# Altium schematic sheet 松菸_幻影光靈_屍禁_通靈板.SchDoc
size A4
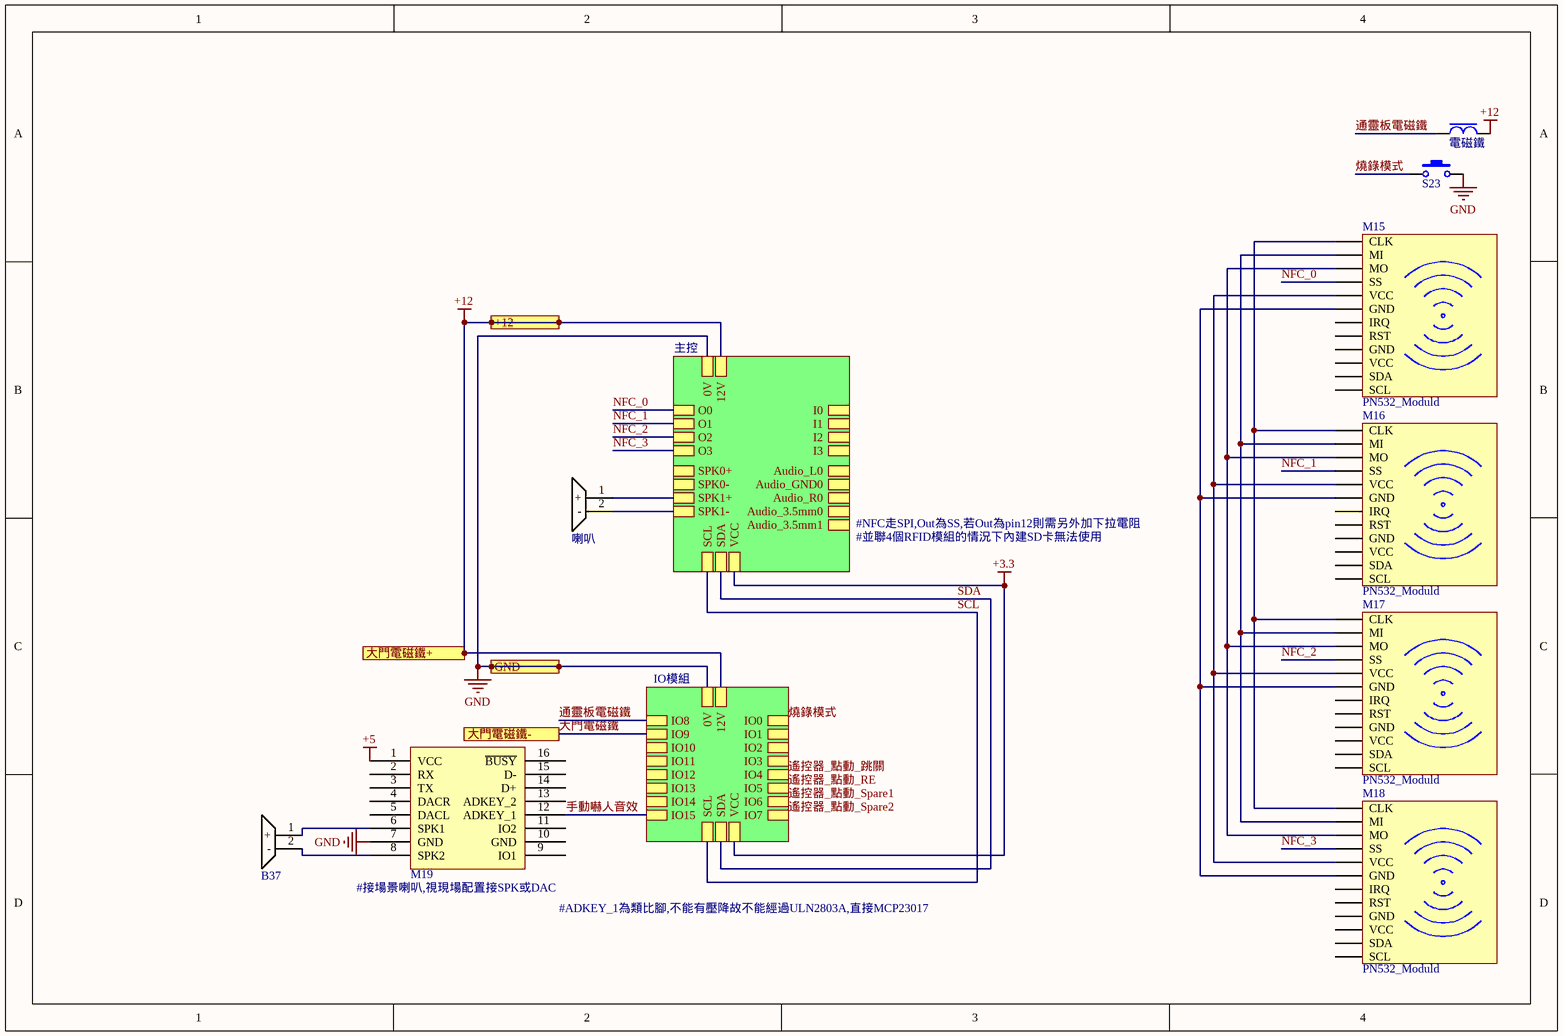
[diagram p0: 松菸_幻影光靈_屍禁_通靈板.SchDoc]

## Parts
B34  喇叭  [Buzzer_12085]
B37  FMB1275-05  [Buzzer_12085]  (value not drawn)
I8  電磁鐵  [Inductor-0420]
M15  PN532_Moduld  [PN532]
M16  PN532_Moduld  [PN532]
M17  PN532_Moduld  [PN532]
M18  PN532_Moduld  [PN532]
M19  BY8001-16P  [BY8001-16P]  (value not drawn)
S23  Switch  [Switch SMD-3.6*6*2.5]  (value not drawn)

## Sub-sheets
IO模組 = IO模組_MCP23017_20240819.SchDoc: VCC, 12V, 0V, SCL, SDA, IO15, IO14, IO10, IO0, IO3, IO4, IO5, IO8, IO11, IO6, IO7, IO12, IO13, IO2, IO1, IO9
主控 = ESP32主控_20240812.SchDoc: 12V, SDA, VCC, 0V, SCL, O3, O2, O1, O0, I3, I2, I1, I0, SPK0+, Audio_3.5mm1, Audio_L0, SPK0-, Audio_R0, SPK1+, SPK1-, Audio_3.5mm0, Audio_GND0

## Ports
+12, GND, 大門電磁鐵+, 大門電磁鐵-

## Nets
+3.3: sheet 主控/VCC, sheet IO模組/VCC
+5: M19.1(VCC)
+12: I8.2 ; port +12, port 大門電磁鐵+, sheet 主控/12V, sheet IO模組/12V
GND: M19.7(GND) S23.2 ; port GND, sheet 主控/0V, sheet IO模組/0V
NFC_0: M15.4(SS) ; sheet 主控/O0
NFC_1: M16.4(SS) ; sheet 主控/O1
NFC_2: M17.4(SS) ; sheet 主控/O2
NFC_3: M18.4(SS) ; sheet 主控/O3
SCL: sheet 主控/SCL, sheet IO模組/SCL
SDA: sheet 主控/SDA, sheet IO模組/SDA
大門電磁鐵: port 大門電磁鐵-, sheet IO模組/IO9
手動嚇人音效: M19.12(ADKEY_1) ; sheet IO模組/IO15
燒錄模式: S23.1 ; sheet IO模組/IO0
通靈板電磁鐵: I8.1 ; sheet IO模組/IO8
遙控器_點動_RE: sheet IO模組/IO5
遙控器_點動_Spare1: sheet IO模組/IO6
遙控器_點動_Spare2: sheet IO模組/IO7
遙控器_點動_跳關: sheet IO模組/IO4
NetB34_1: B34.1(+) ; sheet 主控/SPK1+
NetB34_2: B34.2(-) ; sheet 主控/SPK1-
NetB37_1: B37.1(+) M19.6(SPK1)
NetB37_2: B37.2(-) M19.8(SPK2)
NetM15_1: M15.1(CLK) M16.1(CLK) M17.1(CLK) M18.1(CLK)
NetM15_2: M15.2(MI) M16.2(MI) M17.2(MI) M18.2(MI)
NetM15_3: M15.3(MO) M16.3(MO) M17.3(MO) M18.3(MO)
NetM15_5: M15.5(VCC) M16.5(VCC) M17.5(VCC) M18.5(VCC)
NetM15_6: M15.6(GND) M16.6(GND) M17.6(GND) M18.6(GND)

Not connected (* = marked no-connect by the designer): M15 7(IRQ) 8(RST) 9(GND) 10(VCC) 11(SDA) 12(SCL); M16 7(IRQ) 8(RST) 9(GND) 10(VCC) 11(SDA) 12(SCL); M17 7(IRQ) 8(RST) 9(GND) 10(VCC) 11(SDA) 12(SCL); M18 7(IRQ) 8(RST) 9(GND) 10(VCC) 11(SDA) 12(SCL); M19 2(RX) 3(TX) 4(DACR) 5(DACL) 9(IO1) 10(GND) 11(IO2) 13(ADKEY_2) 14(D+) 15(D-) 16(~{BUSY})

## Notes on the sheet
- #並聯4個RFID模組的情況下內建SD卡無法使用
- #NFC走SPI,Out為SS,若Out為pin12則需另外加下拉電阻
- (near B37) #接場景喇叭,視現場配置接SPK或DAC
- #ADKEY_1為類比腳,不能有壓降故不能經過ULN2803A,直接MCP23017

## Library data of the parts
B34 B37 = Buzzer: 無源蜂鳴器
I8 = Inductor: 一體成型電感
M15-M18 = PN532_Moduld: NFC模組
M19 = Mini MP3 Player: TTL通訊SD卡撥放mp3模組
S23 = Switch: 開關_按鍵